# Altium schematic sheet Sheet1.SchDoc
size A
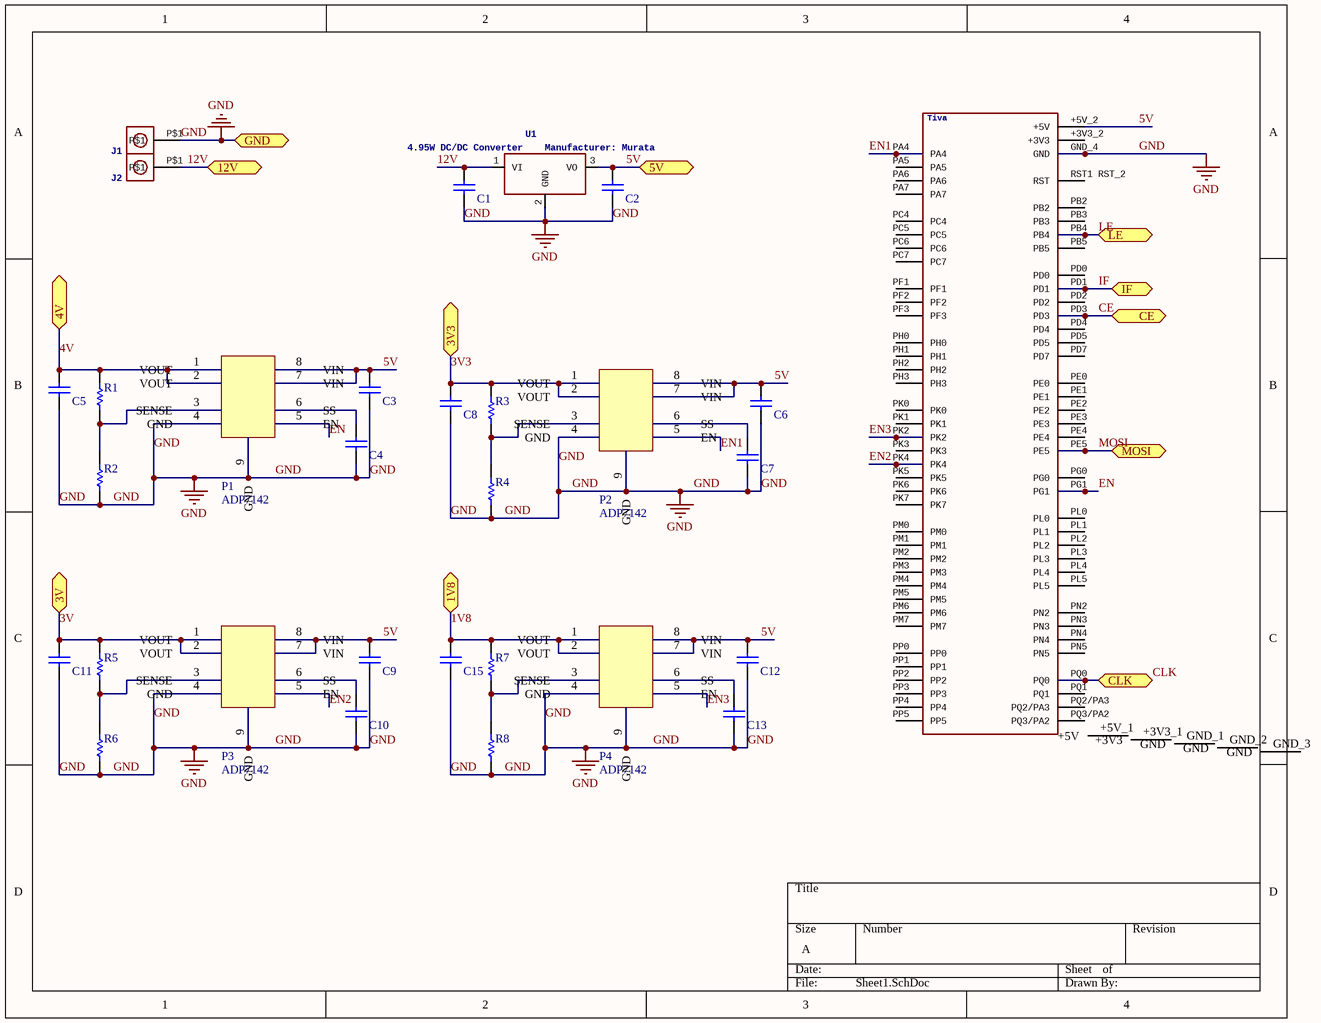
[diagram p0: Sheet1.SchDoc]

## Parts
C1  CAP 10uF 16V 0603(1608)  [CAPC0603(1608)100_L]  (value not drawn)
C2  CAP 22uF 16V 0603(1608)  [CAPC0603(1608)100_L]  (value not drawn)
C3  CAP 2.2uF 16V 0603(1608)  [CAPC0603(1608)100_L]  (value not drawn)
C4  CAP 1nF 16V 0603(1608)  [CAPC0603(1608)100_L]  (value not drawn)
C5  CAP 2.2uF 16V 0603(1608)  [CAPC0603(1608)100_L]  (value not drawn)
C6  CAP 2.2uF 16V 0603(1608)  [CAPC0603(1608)100_L]  (value not drawn)
C7  CAP 1nF 16V 0603(1608)  [CAPC0603(1608)100_L]  (value not drawn)
C8  CAP 2.2uF 16V 0603(1608)  [CAPC0603(1608)100_L]  (value not drawn)
C9  CAP 2.2uF 16V 0603(1608)  [CAPC0603(1608)100_L]  (value not drawn)
C10  CAP 1nF 16V 0603(1608)  [CAPC0603(1608)100_L]  (value not drawn)
C11  CAP 2.2uF 16V 0603(1608)  [CAPC0603(1608)100_L]  (value not drawn)
C12  CAP 2.2uF 16V 0603(1608)  [CAPC0603(1608)100_L]  (value not drawn)
C13  CAP 1nF 16V 0603(1608)  [CAPC0603(1608)100_L]  (value not drawn)
C15  CAP 2.2uF 16V 0603(1608)  [CAPC0603(1608)100_L]  (value not drawn)
J1  http://www.powerwerx.com/anderson-powerpoles/  [APP45_PCB_HORIZ_RIGHT]  (value not drawn)
J2  http://www.powerwerx.com/anderson-powerpoles/  [APP45_PCB_HORIZ_RIGHT]  (value not drawn)
P1  ADP7142  [SOIC127P600X175_HS-9N]
P2  ADP7142  [SOIC127P600X175_HS-9N]
P3  ADP7142  [SOIC127P600X175_HS-9N]
P4  ADP7142  [SOIC127P600X175_HS-9N]
R1  500 1% 0603(1608)  [RESC0603(1608)_N]  (value not drawn)
R2  215 1% 0603(1608)  [RESC0603(1608)_N]  (value not drawn)
R3  500 1% 0603(1608)  [RESC0603(1608)_N]  (value not drawn)
R4  287 1% 0603(1608)  [RESC0603(1608)_N]  (value not drawn)
R5  500 1% 0603(1608)  [RESC0603(1608)_N]  (value not drawn)
R6  332 1% 0603(1608)  [RESC0603(1608)_N]  (value not drawn)
R7  1000 1% 0603(1608)  [RESC0603(1608)_N]  (value not drawn)
R8  500 1% 0603(1608)  [RESC0603(1608)_N]  (value not drawn)
Tiva  TIVA C CONNECTED LAUNCHPAD  [TIVA-C-CONNECTED]  (value not drawn)
U1  4.95W DC/DC Converter    Manufacturer: Murata  [OKI-78SR_HORIZ]

## Ports
1V8, 3V, 3V3, 4V, 5V, 12V, CE, CLK, GND, IF, LE, MOSI

## Nets
GND: C1.2 C2.2 C3.2 C4.2 C5.2 C6.2 C7.2 C8.2 C9.2 C10.2 C11.2 C12.2 C13.2 C15.2 J1.P$1 P1.4(GND) P1.9(GND) P2.4(GND) P2.9(GND) P3.4(GND) P3.9(GND) P4.4(GND) P4.9(GND) R2.1 R4.1 R6.1 R8.1 Tiva.GND_4(GND) U1.2(GND) ; port GND
1V8: C15.1 P4.1(VOUT) P4.2(VOUT) R7.2 ; port 1V8
3V: C11.1 P3.1(VOUT) P3.2(VOUT) R5.2 ; port 3V
3V3: C8.1 P2.1(VOUT) P2.2(VOUT) R3.2 ; port 3V3
4V: C5.1 P1.1(VOUT) P1.2(VOUT) R1.2 ; port 4V
5V: C2.1 C3.1 C6.1 C9.1 C12.1 P1.7(VIN) P1.8(VIN) P2.7(VIN) P2.8(VIN) P3.7(VIN) P3.8(VIN) P4.7(VIN) P4.8(VIN) Tiva.+5V_2(+5V) U1.3(VO) ; port 5V
12V: C1.1 J2.P$1 U1.1(VI) ; port 12V
CE: Tiva.PD3 ; port CE
CLK: Tiva.PQ0 ; port CLK
EN: P1.5(EN) Tiva.PG1
EN1: P2.5(EN) Tiva.PA4
EN2: P3.5(EN) Tiva.PK4
EN3: P4.5(EN) Tiva.PK2
IF: Tiva.PD1 ; port IF
LE: Tiva.PB4 ; port LE
MOSI: Tiva.PE5 ; port MOSI
NetC4_1: C4.1 P1.6(SS)
NetC7_1: C7.1 P2.6(SS)
NetC10_1: C10.1 P3.6(SS)
NetC13_1: C13.1 P4.6(SS)
NetP1_3: P1.3(SENSE) R1.1 R2.2
NetP2_3: P2.3(SENSE) R3.1 R4.2
NetP3_3: P3.3(SENSE) R5.1 R6.2
NetP4_3: P4.3(SENSE) R7.1 R8.2

Not connected (* = marked no-connect by the designer): Tiva +3V3_1(+3V3) +3V3_2(+3V3) +5V_1(+5V) GND_1(GND) GND_2(GND) GND_3(GND) PA5 PA6 PA7 PB2 PB3 PB5 PC4 PC5 PC6 PC7 PD0 PD2 PD4 PD5 PD7 PE0 PE1 PE2 PE3 PE4 PF1 PF2 PF3 PG0 PH0 PH1 PH2 PH3 PK0 PK1 PK3 PK5 PK6 PK7 PL0 PL1 PL2 PL3 PL4 PL5 PM0 PM1 PM2 PM3 PM4 PM5 PM6 PM7 PN2 PN3 PN4 PN5 PP0 PP1 PP2 PP3 PP4 PP5 PQ1 PQ2/PA3 PQ3/PA2 RST1 RST_2(RST)

## Library data of the parts
C1 = CMP-1035-01744-1: CAP 10uF 16V ±1% 0603 (1608 Metric) Thickness 1mm SMD; Tolerance: Â±1%; Case-Metric: 1608; Case-EIA: 0603; Technology: SMT; Max Thickness: 1 mm; Value: 10uF; Rated Voltage: 16 V
C2 = CMP-1035-01744-1: CAP 22uF 16V ±1% 0603 (1608 Metric) Thickness 1mm SMD; Tolerance: Â±1%; Case-Metric: 1608; Case-EIA: 0603; Technology: SMT; Max Thickness: 1 mm; Value: 22uF; Rated Voltage: 16 V
C3 C5 C6 C8 C9 C11 C12 C15 = CMP-1035-01744-1: CAP 2.2uF 16V ±1% 0603 (1608 Metric) Thickness 1mm SMD; Tolerance: Â±1%; Case-Metric: 1608; Case-EIA: 0603; Technology: SMT; Max Thickness: 1 mm; Value: 2.2uF; Rated Voltage: 16 V
C4 C7 C10 C13 = CMP-1035-01744-1: CAP 1nF 16V ±1% 0603 (1608 Metric) Thickness 1mm SMD; Tolerance: Â±1%; Case-Metric: 1608; Case-EIA: 0603; Technology: SMT; Max Thickness: 1 mm; Value: 1nF; Rated Voltage: 16 V
J1 = APPPP45_PCB_HORIZ_RIGHT: COLOR1: GN
J2 = APPPP45_PCB_HORIZ_RIGHT: COLOR1: 12V
R1 R3 R5 R8 = CMP-1012-00736-1: 500 0.1W 1% 0603 (1608 Metric)  SMD; Value: 500 Ohm; Case-Metric: 1608; Case-EIA: 0603; Power: 0.1 W; Tolerance: 1 %; Technology: SMT
R2 = CMP-1012-00736-1: 215 0.1W 1% 0603 (1608 Metric)  SMD; Value: 215 Ohm; Case-Metric: 1608; Case-EIA: 0603; Power: 0.1 W; Tolerance: 1 %; Technology: SMT
R4 = CMP-1012-00736-1: 287 0.1W 1% 0603 (1608 Metric)  SMD; Value: 287 Ohm; Case-Metric: 1608; Case-EIA: 0603; Power: 0.1 W; Tolerance: 1 %; Technology: SMT
R6 = CMP-1012-00736-1: 332 0.1W 1% 0603 (1608 Metric)  SMD; Value: 332 Ohm; Case-Metric: 1608; Case-EIA: 0603; Power: 0.1 W; Tolerance: 1 %; Technology: SMT
R7 = CMP-1012-00736-1: 1000 0.1W 1% 0603 (1608 Metric)  SMD; Value: 1000 Ohm; Case-Metric: 1608; Case-EIA: 0603; Power: 0.1 W; Tolerance: 1 %; Technology: SMT
Tiva = TIVA-1294
U1 = OKI-78SR-*/1.5-W36?CH: 12 to 5V converter; VOUT: +3v3